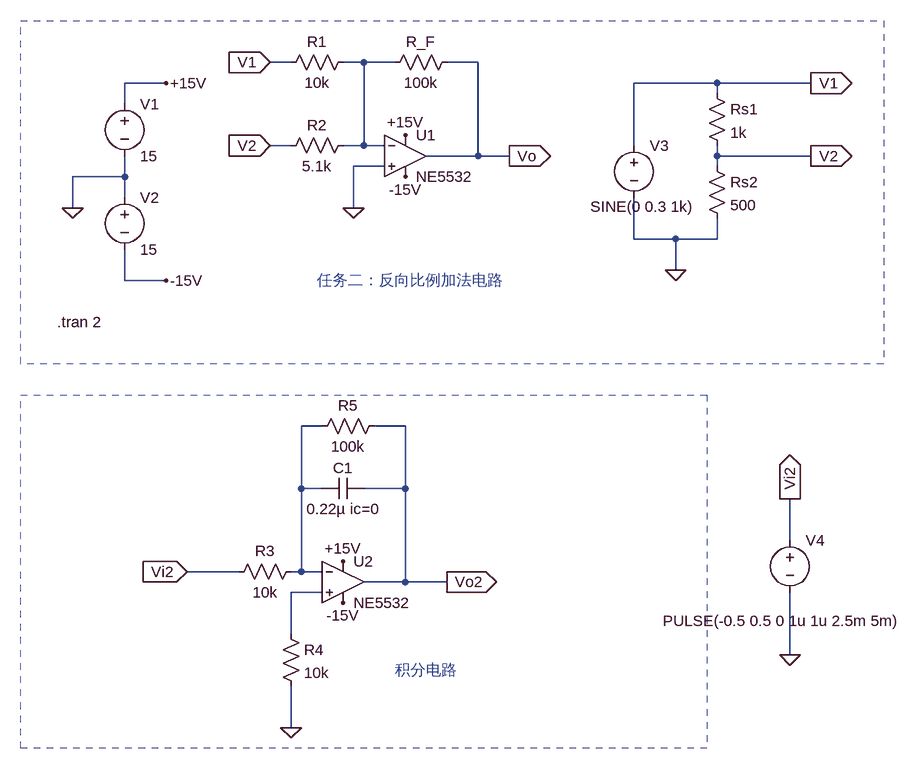
[diagram p0: schematic Class1仿真.asc]
Class1仿真.asc, the LTspice schematic file:
Version 4
SHEET 1 880 1076
WIRE -112 16 -144 16
WIRE 0 16 -32 16
WIRE 48 16 0 16
WIRE 176 16 128 16
WIRE -304 48 -368 48
WIRE 544 48 416 48
WIRE 688 48 544 48
WIRE 544 64 544 48
WIRE -368 80 -368 48
WIRE -112 144 -144 144
WIRE 0 144 0 16
WIRE 0 144 -32 144
WIRE 32 144 0 144
WIRE 416 144 416 48
WIRE 176 160 176 16
WIRE 176 160 96 160
WIRE 224 160 176 160
WIRE 544 160 544 144
WIRE 688 160 544 160
WIRE 32 176 -16 176
WIRE 544 176 544 160
WIRE -368 192 -368 160
WIRE -368 192 -448 192
WIRE -368 224 -368 192
WIRE -448 240 -448 192
WIRE -16 240 -16 176
WIRE 416 288 416 224
WIRE 480 288 416 288
WIRE 544 288 544 256
WIRE 544 288 480 288
WIRE 480 336 480 288
WIRE -368 352 -368 304
WIRE -304 352 -368 352
WIRE -64 576 -96 576
WIRE 64 576 16 576
WIRE -96 672 -96 576
WIRE -64 672 -96 672
WIRE 64 672 64 576
WIRE 64 672 0 672
WIRE 656 752 656 688
WIRE -192 800 -272 800
WIRE -96 800 -96 672
WIRE -96 800 -112 800
WIRE -64 800 -96 800
WIRE 64 816 64 672
WIRE 64 816 0 816
WIRE 128 816 64 816
WIRE -64 832 -112 832
WIRE -112 896 -112 832
WIRE 656 928 656 832
WIRE -112 1040 -112 976
FLAG -448 240 0
FLAG -304 48 +15V
FLAG -304 352 -15V
FLAG 64 128 +15V
FLAG 64 192 -15V
FLAG -16 240 0
FLAG -144 16 V1
IOPIN -144 16 In
FLAG -144 144 V2
IOPIN -144 144 In
FLAG 224 160 Vo
IOPIN 224 160 Out
FLAG 688 48 V1
IOPIN 688 48 Out
FLAG 688 160 V2
IOPIN 688 160 Out
FLAG 480 336 0
FLAG -32 784 +15V
FLAG -32 848 -15V
FLAG -112 1040 0
FLAG 128 816 Vo2
IOPIN 128 816 Out
FLAG 656 928 0
FLAG -272 800 Vi2
IOPIN -272 800 In
FLAG 656 688 Vi2
IOPIN 656 688 Out
SYMBOL EXTRA\\AudioOpamp\\TI\\NE5532 64 160 R0
SYMATTR InstName U1
SYMBOL res -16 0 R90
WINDOW 0 0 56 VBottom 2
WINDOW 3 32 56 VTop 2
SYMATTR InstName R1
SYMATTR Value 10k
SYMBOL res -16 128 R90
WINDOW 0 0 56 VBottom 2
WINDOW 3 32 56 VTop 2
SYMATTR InstName R2
SYMATTR Value 5.1k
SYMBOL res 144 0 R90
WINDOW 0 0 56 VBottom 2
WINDOW 3 32 56 VTop 2
SYMATTR InstName R_F
SYMATTR Value 100k
SYMBOL voltage -368 64 R0
WINDOW 123 0 0 Left 0
WINDOW 39 0 0 Left 0
SYMATTR InstName V1
SYMATTR Value 15
SYMBOL voltage -368 208 R0
WINDOW 123 0 0 Left 0
WINDOW 39 0 0 Left 0
SYMATTR InstName V2
SYMATTR Value 15
SYMBOL voltage 416 128 R0
WINDOW 3 -67 110 Left 2
WINDOW 123 0 0 Left 0
WINDOW 39 0 0 Left 0
SYMATTR Value SINE(0 0.3 1k)
SYMATTR InstName V3
SYMBOL res 528 48 R0
SYMATTR InstName Rs1
SYMATTR Value 1k
SYMBOL res 528 160 R0
SYMATTR InstName Rs2
SYMATTR Value 500
SYMBOL EXTRA\\AudioOpamp\\TI\\NE5532 -32 816 R0
SYMATTR InstName U2
SYMBOL res -96 784 R90
WINDOW 0 0 56 VBottom 2
WINDOW 3 32 56 VTop 2
SYMATTR InstName R3
SYMATTR Value 10k
SYMBOL res -128 880 R0
SYMATTR InstName R4
SYMATTR Value 10k
SYMBOL cap 0 656 R90
WINDOW 0 0 32 VBottom 2
WINDOW 3 32 32 VTop 2
SYMATTR InstName C1
SYMATTR Value 0.22µ ic=0
SYMBOL res 32 560 R90
WINDOW 0 0 56 VBottom 2
WINDOW 3 32 56 VTop 2
SYMATTR InstName R5
SYMATTR Value 100k
SYMBOL voltage 656 736 R0
WINDOW 3 -196 140 Left 2
WINDOW 123 0 0 Left 0
WINDOW 39 0 0 Left 0
SYMATTR Value PULSE(-0.5 0.5 0 1u 1u 2.5m 5m)
SYMATTR InstName V4
TEXT -472 416 Left 2 !.tran 2
TEXT -72 352 Left 2 ;任务二：反向比例加法电路
TEXT 48 952 Left 2 ;积分电路
RECTANGLE Normal 800 480 -528 -48 2
RECTANGLE Normal 528 1072 -528 528 2

The netlist it stands for:
* Class1仿真.asc
XU1 0 N001 +15V -15V Vo NE5532  ; pins In+ In- V+ V- OUT
R1 N001 V1 10k
R2 N001 V2 5.1k
R_F Vo N001 100k
V1 +15V 0 15
V2 0 -15V 15
V3 V1 0 SINE(0 0.3 1k)
Rs1 V1 V2 1k
Rs2 V2 0 500
XU2 N003 N002 +15V -15V Vo2 NE5532  ; pins In+ In- V+ V- OUT
R3 N002 Vi2 10k
R4 N003 0 10k
C1 Vo2 N002 0.22µ ic=0
R5 Vo2 N002 100k
V4 Vi2 0 PULSE(-0.5 0.5 0 1u 1u 2.5m 5m)
.tran 2
* 任务二：反向比例加法电路
* 积分电路
.backanno
.end